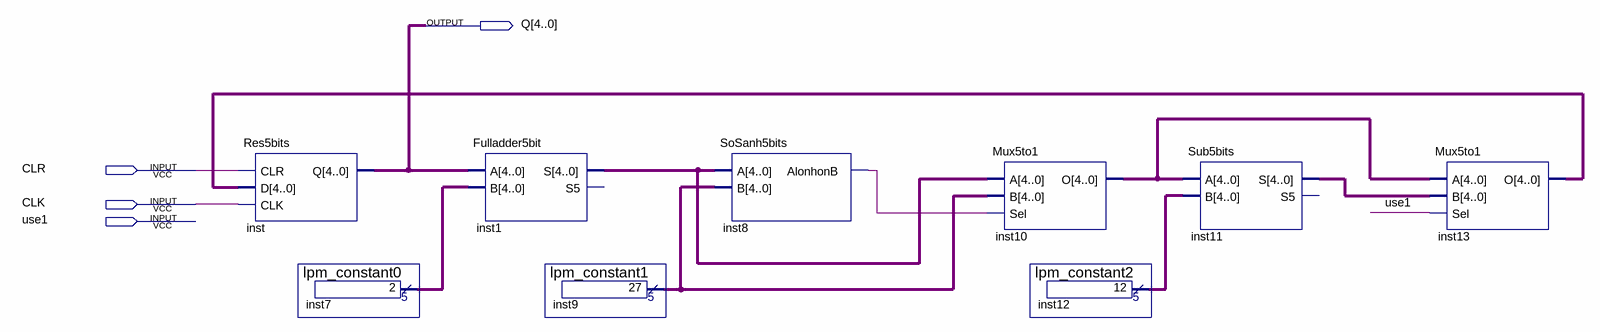
[diagram p0: schematic sheet]
// Quartus schematic Mana_Block.bdf as structural Verilog: 9 symbols, 4 pins
module Mana_Block (
  input  CLR,
  input  CLK,
  input  use1,
  output [4:0] Q
);

  wire inst8_alonhonb;
  wire [4:0] inst1_s, inst7_result, inst9_result, inst10_o, inst11_s, inst12_result, inst13_o;

  Res5bits inst (.CLR(CLR), .D(inst13_o), .CLK(CLK), .Q(Q));
  lpm_constant0 inst7 (.result(inst7_result));
  Fulladder5bit inst1 (.A(Q), .B(inst7_result), .S(inst1_s));  // open: S5
  lpm_constant1 inst9 (.result(inst9_result));
  SoSanh5bits inst8 (.A(inst1_s), .B(inst9_result), .AlonhonB(inst8_alonhonb));
  Mux5to1 inst10 (.A(inst1_s), .B(inst9_result), .Sel(inst8_alonhonb), .O(inst10_o));
  lpm_constant2 inst12 (.result(inst12_result));
  Sub5bits inst11 (.A(inst10_o), .B(inst12_result), .S(inst11_s));  // open: S5
  Mux5to1 inst13 (.A(inst10_o), .B(inst11_s), .Sel(use1), .O(inst13_o));
endmodule
